# EAGLE design Lumiboard - main board (rev B) (EAGLE 6.4)
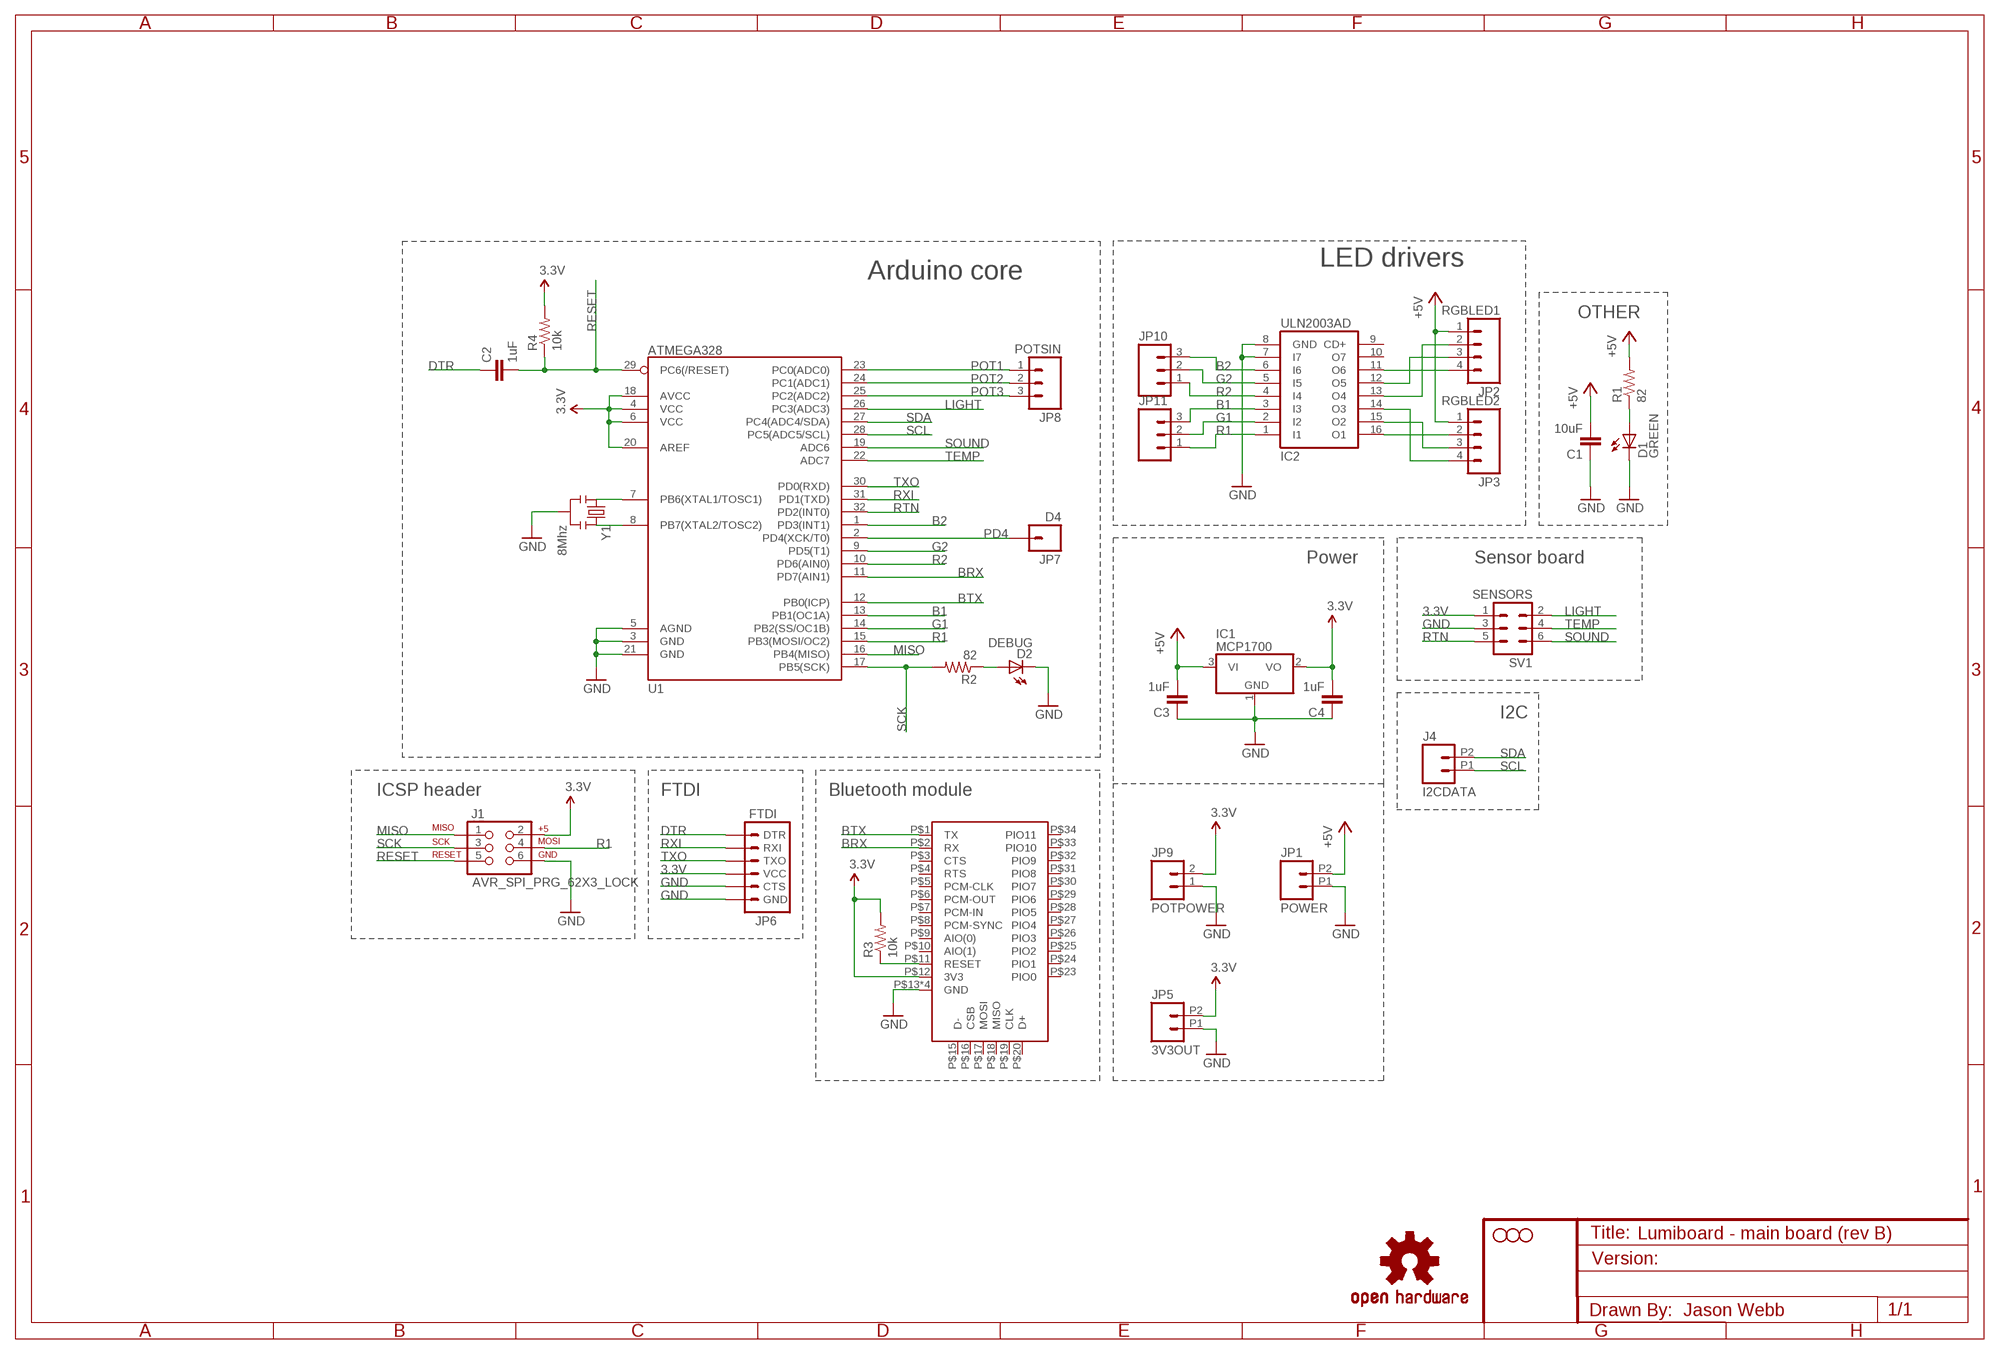
[diagram p0: schematic, sheet 1]

## Parts
C1  10uF  CAP0805  [0805]
C2  1uF  CAP0805  [0805]
C3  1uF  CAP0805  [0805]
C4  1uF  CAP0805  [0805]
D1  GREEN  LEDCHIPLED_0805  [CHIPLED_0805]
D2  DEBUG  LEDCHIPLED_0805  [CHIPLED_0805]
H1  STAND-OFFTIGHT  [STAND-OFF-TIGHT]
H2  STAND-OFFTIGHT  [STAND-OFF-TIGHT]
H3  STAND-OFFTIGHT  [STAND-OFF-TIGHT]
IC1  MCP1700  MCP1703CB  [SOT23]
IC2  ULN2003AD  [SO16]
J1  AVR_SPI_PRG_62X3_LOCK  [2X3_LOCK]
J4  I2CDATA  M022.54MM_SCREWTERM  [1X02_2.54_SCREWTERM]
JP1  POWER  M022.54MM_SCREWTERM  [1X02_2.54_SCREWTERM]
JP2  RGBLED1  M04PTH  [1X04]
JP3  RGBLED2  M04PTH  [1X04]
JP5  3V3OUT  M022.54MM_SCREWTERM  [1X02_2.54_SCREWTERM]
JP6  FTDI  ARDUINO_SERIAL_PROGRAMLOCK  [1X06_LOCK]
JP7  D4  M01PTH  [1X01]
JP8  POTSIN  M03PTH  [1X03]
JP9  POTPOWER  M02PTH  [1X02]
JP10  M03PTH  [1X03]
JP11  M03PTH  [1X03]
LOGO1  OSHW-LOGOL  [OSHW-LOGO-L]
R1  82  R-US_R0805  [R0805]
R2  82  R-US_R0805  [R0805]
R3  10k  R-US_R0805  [R0805]
R4  10k  R-US_R0805  [R0805]
SV1  SENSORS  ML6  [ML6]
U1  ATMEGA328  ATMEGA168  [TQFP32-08]
U2  DX_BT_MODULE  [DXBLUETOOTHMODULE]
Y1  8Mhz  RESONATORSMD  [RESONATOR-SMD]

## Nets
3.3V: C4.2 IC1.2(VO) J1.2 JP5.P2 JP6.4(VCC) JP9.2 R3.2 R4.2 SV1.1 U1.4(VCC) U1.6(VCC) U1.18(AVCC) U1.20(AREF) U2.P$12(3V3)
+5V: C1.2 C3.2 IC1.3(VI) JP1.P2 JP2.1 JP3.1 R1.2
B1: IC2.3(I3) JP11.3 U1.13(PB1(OC1A))
B2: IC2.6(I6) JP10.3 U1.1(PD3(INT1))
BRX: U1.11(PD7(AIN1)) U2.P$2(RX)
BTRESET: R3.1 U2.P$11(RESET)
BTX: U1.12(PB0(ICP)) U2.P$1(TX)
DTR: C2.1 JP6.1(DTR)
G1: IC2.2(I2) JP11.2 U1.14(PB2(SS/OC1B))
G2: IC2.5(I5) JP10.2 U1.9(PD5(T1))
GND: C1.1 C3.1 C4.1 D1.C D2.C IC1.1(GND) IC2.7(I7) IC2.8(GND) J1.6 JP1.P1 JP5.P1 JP6.5(CTS) JP6.6(GND) JP9.1 SV1.3 U1.3(GND) U1.5(AGND) U1.21(GND) U2.P$13(GND) U2.P$14(GND) U2.P$21(GND) U2.P$22(GND) Y1.2
LIGHT: SV1.2 U1.26(PC3(ADC3))
MISO: J1.1 U1.16(PB4(MISO))
N$1: IC2.16(O1) JP3.2
N$3: IC2.15(O2) JP3.3
N$4: IC2.13(O4) JP2.2
N$5: IC2.14(O3) JP3.4
N$6: IC2.12(O5) JP2.3
N$7: U1.7(PB6(XTAL1/TOSC1)) Y1.1
N$8: U1.8(PB7(XTAL2/TOSC2)) Y1.3
N$9: D1.A R1.1
N$10: IC2.11(O6) JP2.4
N$13: D2.A R2.1
PD4: JP7.1 U1.2(PD4(XCK/T0))
POT1: JP8.1 U1.23(PC0(ADC0))
POT2: JP8.2 U1.24(PC1(ADC1))
POT3: JP8.3 U1.25(PC2(ADC2))
R1: IC2.1(I1) J1.4 JP11.1 U1.15(PB3(MOSI/OC2))
R2: IC2.4(I4) JP10.1 U1.10(PD6(AIN0))
RESET: C2.2 J1.5 R4.1 U1.29(PC6(/RESET))
RTN: SV1.5 U1.32(PD2(INT0))
RXI: JP6.2(RXI) U1.31(PD1(TXD))
SCK: J1.3 R2.2 U1.17(PB5(SCK))
SCL: J4.P1 U1.28(PC5(ADC5/SCL))
SDA: J4.P2 U1.27(PC4(ADC4/SDA))
SOUND: SV1.6 U1.19(ADC6)
TEMP: SV1.4 U1.22(ADC7)
TXO: JP6.3(TXO) U1.30(PD0(RXD))
Unconnected: IC2.9(CD+) IC2.10(O7) U2.P$3(CTS) U2.P$4(RTS) U2.P$5(PCM-CLK) U2.P$6(PCM-OUT) U2.P$7(PCM-IN) U2.P$8(PCM-SYNC) U2.P$9(AIO(0)) U2.P$10(AIO(1)) U2.P$15(D-) U2.P$16(CSB) U2.P$17(MOSI) U2.P$18(MISO) U2.P$19(CLK) U2.P$20(D+) U2.P$23(PIO0) U2.P$24(PIO1) U2.P$25(PIO2) U2.P$26(PIO3) U2.P$27(PIO4) U2.P$28(PIO5) U2.P$29(PIO6) U2.P$30(PIO7) U2.P$31(PIO8) U2.P$32(PIO9) U2.P$33(PIO10) U2.P$34(PIO11)

## Notes on the sheet
- LED drivers
- Arduino core
- OTHER
- Power | Sensor board
- I2C
- ICSP header | FTDI | Bluetooth module
- Jason Webb

## Library data of the parts
C1-C4 = SparkFun:CAP: Capacitor Standard 0603 ceramic capacitor, and 0.1" leaded capacitor.
D1 D2 = led:LED: LED OSRAM: - CHIPLED LG R971, LG N971, LY N971, LG Q971, LY Q971, LO R971, LY R971 LH N974, LH R974 LS Q976, LO Q976, LY Q976 LO Q996 - Hyper CHIPLED LW Q18S LB Q993, LB Q99A, LB R99A - SideLED LS A670, LO A670, LY A670, LG A670, LP A670 LB A673, LV A673, LT A673, LW A673 LH A674 LY A675 LS A676, LA A676, LO A676, LY A676, LW A676 LS A679, LY A679, LG A679 - Hyper Micro SIDELED® LS Y876, LA Y876, LO Y876, LY Y876 LT Y87S - SmartLED LW L88C, LW L88S LB L89C, LB L89S, LG L890 LS L89K, LO L89K, LY L89K LS L896, LA L896, LO L896, LY L896 - TOPLED LS T670, LO T670, LY T670, LG T670, LP T670 LSG T670, LSP T670, LSY T670, LOP T670, LYG T670 LG T671, LOG T671, LSG T671 LB T673, LV T673, LT T673, LW T673 LH T674 LS T676, LA T676, LO T676, LY T676, LB T676, LH T676, LSB T676, LW T676 LB T67C, LV T67C, LT T67C, LS T67K, LO T67K, LY T67K, LW E67C LS E67B, LA E67B, LO E67B, LY E67B, LB E67C, LV E67C, LT E67C LW T67C LS T679, LY T679, LG T679 LS T770, LO T770, LY T770, LG T770, LP T770 LB T773, LV T773, LT T773, LW T773 LH T774 LS E675, LA E675, LY E675, LS T675 LS T776, LA T776, LO T776, LY T776, LB T776 LHGB T686 LT T68C, LB T68C - Hyper Mini TOPLED® LB M676 - Mini TOPLED Santana® LG M470 LS M47K, LO M47K, LY M47K Source: http://www.osram.convergy.de LUXEON: - LUMILED® LXK2-PW12-R00, LXK2-PW12-S00, LXK2-PW14-U00, LXK2-PW14-V00 LXK2-PM12-R00, LXK2-PM12-S00, LXK2-PM14-U00 LXK2-PE12-Q00, LXK2-PE12-R00, LXK2-PE12-S00, LXK2-PE14-T00, LXK2-PE14-U00 LXK2-PB12-K00, LXK2-PB12-L00, LXK2-PB12-M00, LXK2-PB14-N00, LXK2-PB14-P00, LXK2-PB14-Q00 LXK2-PR12-L00, LXK2-PR12-M00, LXK2-PR14-Q00, LXK2-PR14-R00 LXK2-PD12-Q00, LXK2-PD12-R00, LXK2-PD12-S00 LXK2-PH12-R00, LXK2-PH12-S00 LXK2-PL12-P00, LXK2-PL12-Q00, LXK2-PL12-R00 Source: www.luxeon.com KINGBRIGHT: KA-3528ASYC Source: www.kingbright.com
H1-H3 = SparkFun:STAND-OFF: Stand Off This is the mechanical footprint for a #4 phillips button head screw. Use the keepout ring to avoid running the screw head into surrounding components. SKU : PRT-00447
IC1 = linear:MCP1703: 250 mA, 16V, Low Quiescent Current LDO Regulator Source: http://ww1.microchip.com/downloads/en/DeviceDoc/22049b.pdf
IC2 = uln-udn:ULN2003A: DRIVER ARRAY
J1 = SparkFun-Connectors:AVR_SPI_PRG_6: AVR ISP 6 Pin This is the reduced ISP connector for AVR programming. Common on Arduino. This footprint will take up less PCB space and can be used with a 10-pin to 6-pin adapter such as SKU: BOB-08508
J4 JP1 JP5 = SparkFun-Connectors:M02: Standard 2-pin 0.1" header. Use with - straight break away headers ( PRT-00116) - right angle break away headers (PRT-00553) - swiss pins (PRT-00743) - machine pins (PRT-00117) - female headers (PRT-00115) Molex polarized connector foot print use with: PRT-08233 with associated crimp pins and housings. 2.54_SCREWTERM for use with PRT-10571. 3.5mm Screw Terminal footprints for PRT-08084 5mm Screw Terminal footprints for use with PRT-08433
JP2 JP3 = SparkFun-Connectors:M04: Header 4 Standard 4-pin 0.1" header. Use with straight break away headers (SKU : PRT-00116), right angle break away headers (PRT-00553), swiss pins (PRT-00743), machine pins (PRT-00117), and female headers (PRT-00115). Molex polarized connector foot print use with SKU : PRT-08231 with associated crimp pins and housings. 1MM SMD Version SKU: PRT-10208
JP6 = SparkFun:ARDUINO_SERIAL_PROGRAM
JP7 = SparkFun-Connectors:M01: Header 1 Standard 1-pin 0.1" header. Use with straight break away headers (SKU : PRT-00116), right angle break away headers (PRT-00553), swiss pins (PRT-00743), machine pins (PRT-00117), and female headers (PRT-00115).
JP8 = SparkFun:M03: Header 3 Standard 3-pin 0.1" header. Use with straight break away headers (SKU : PRT-00116), right angle break away headers (PRT-00553), swiss pins (PRT-00743), machine pins (PRT-00117), and female headers (PRT-00115). Molex polarized connector foot print use with SKU : PRT-08232 with associated crimp pins and housings.
JP9 = SparkFun:M02: Header 2 Standard 2-pin 0.1" header. Use with straight break away headers (SKU : PRT-00116), right angle break away headers (PRT-00553), swiss pins (PRT-00743), machine pins (PRT-00117), and female headers (PRT-00115). Molex polarized connector foot print use with SKU : PRT-08233 with associated crimp pins and housings.
JP10 JP11 = SparkFun-Connectors:M03: Header 3 Standard 3-pin 0.1" header. Use with straight break away headers (SKU : PRT-00116), right angle break away headers (PRT-00553), swiss pins (PRT-00743), machine pins (PRT-00117), and female headers (PRT-00115). Molex polarized connector foot print use with SKU : PRT-08232 with associated crimp pins and housings.
LOGO1 = SparkFun-Aesthetics:OSHW-LOGO: Open Source Hardware Logo This logo indicates the piece of hardware it is found on incorporates a OSHW license and/or adheres to the definition of open source hardware found here: http://freedomdefined.org/OSHW
R1-R4 = resistor:R-US_: RESISTOR, American symbol
SV1 = con-harting-ml:ML6: HARTING; OC_FARNELL: unknown; OC_NEWARK: unknown
U1 = SparkFun:ATMEGA168
U2 = Richardson:DX_BT_MODULE: http://www.dealextreme.com/p/wireless-bluetooth-rs232-ttl-transceiver-module-80711
Y1 = SparkFun:RESONATOR: Resonator Small SMD resonator. This is the itty bitty 10/20MHz resonators with built in caps. CSTCE10M0G55 and CSTCE20M0V53. Footprint has been reviewed closely but hasn't been tested yet.

## Net classes
0 Power: width 0.254 mm, drill 0.305 mm, clearance 0.203 mm

## Board
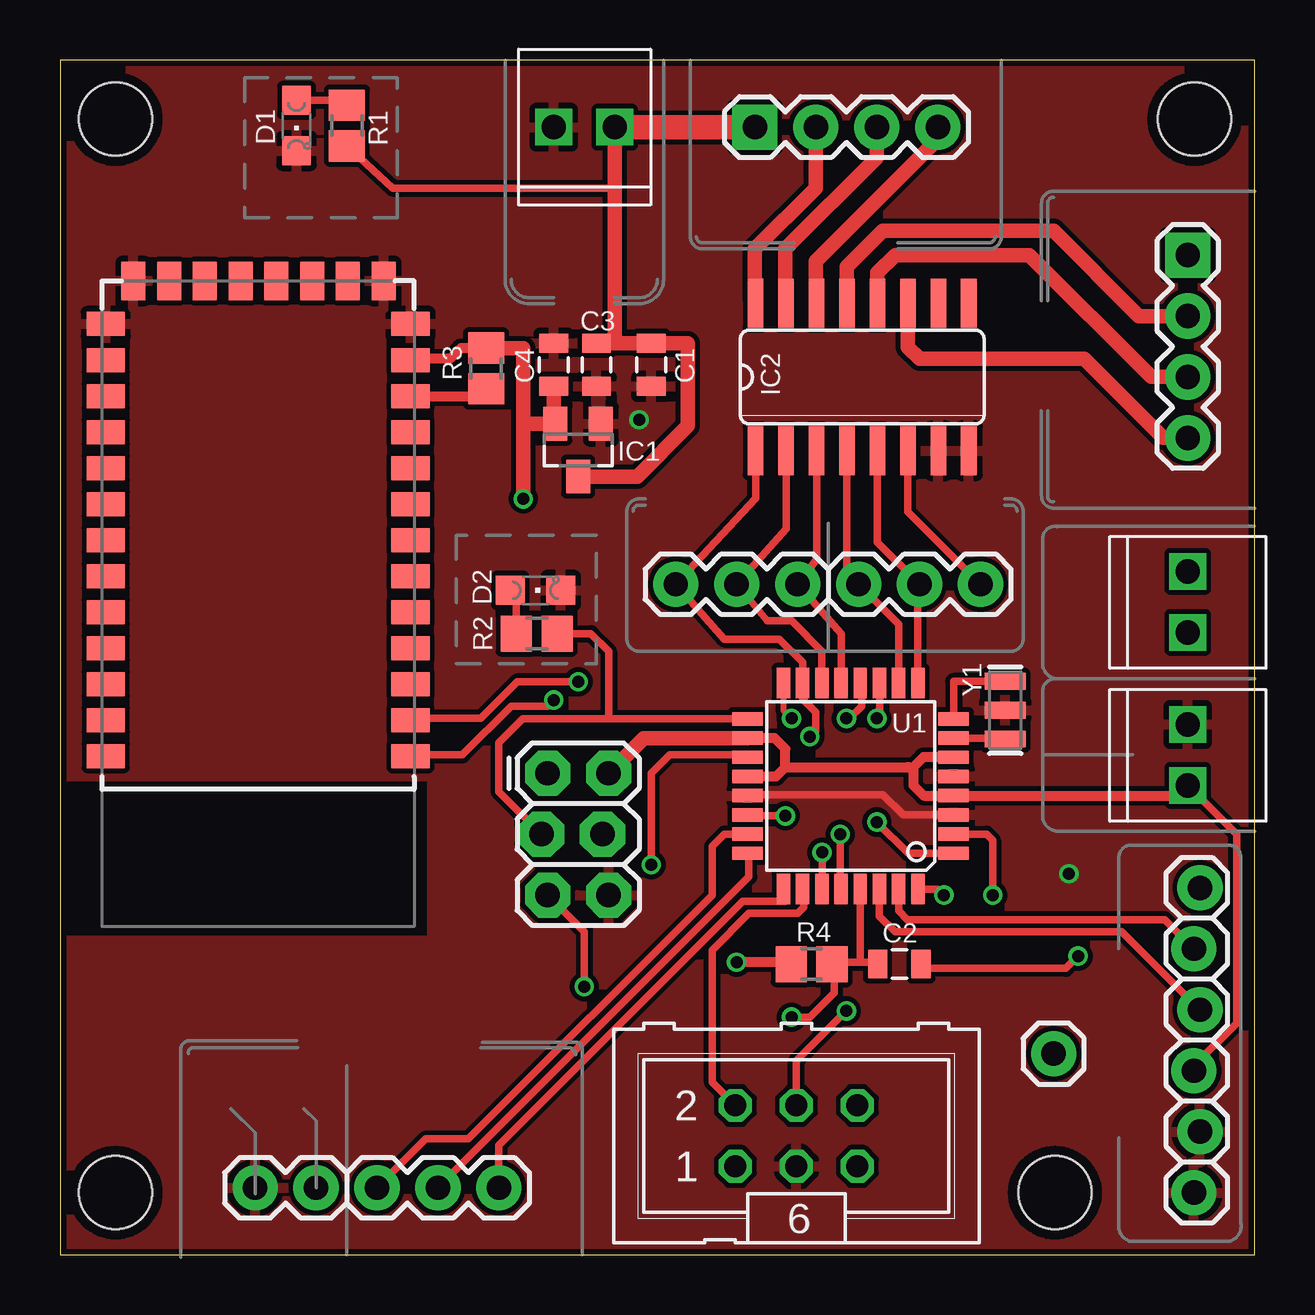
[diagram p1: board, top side]
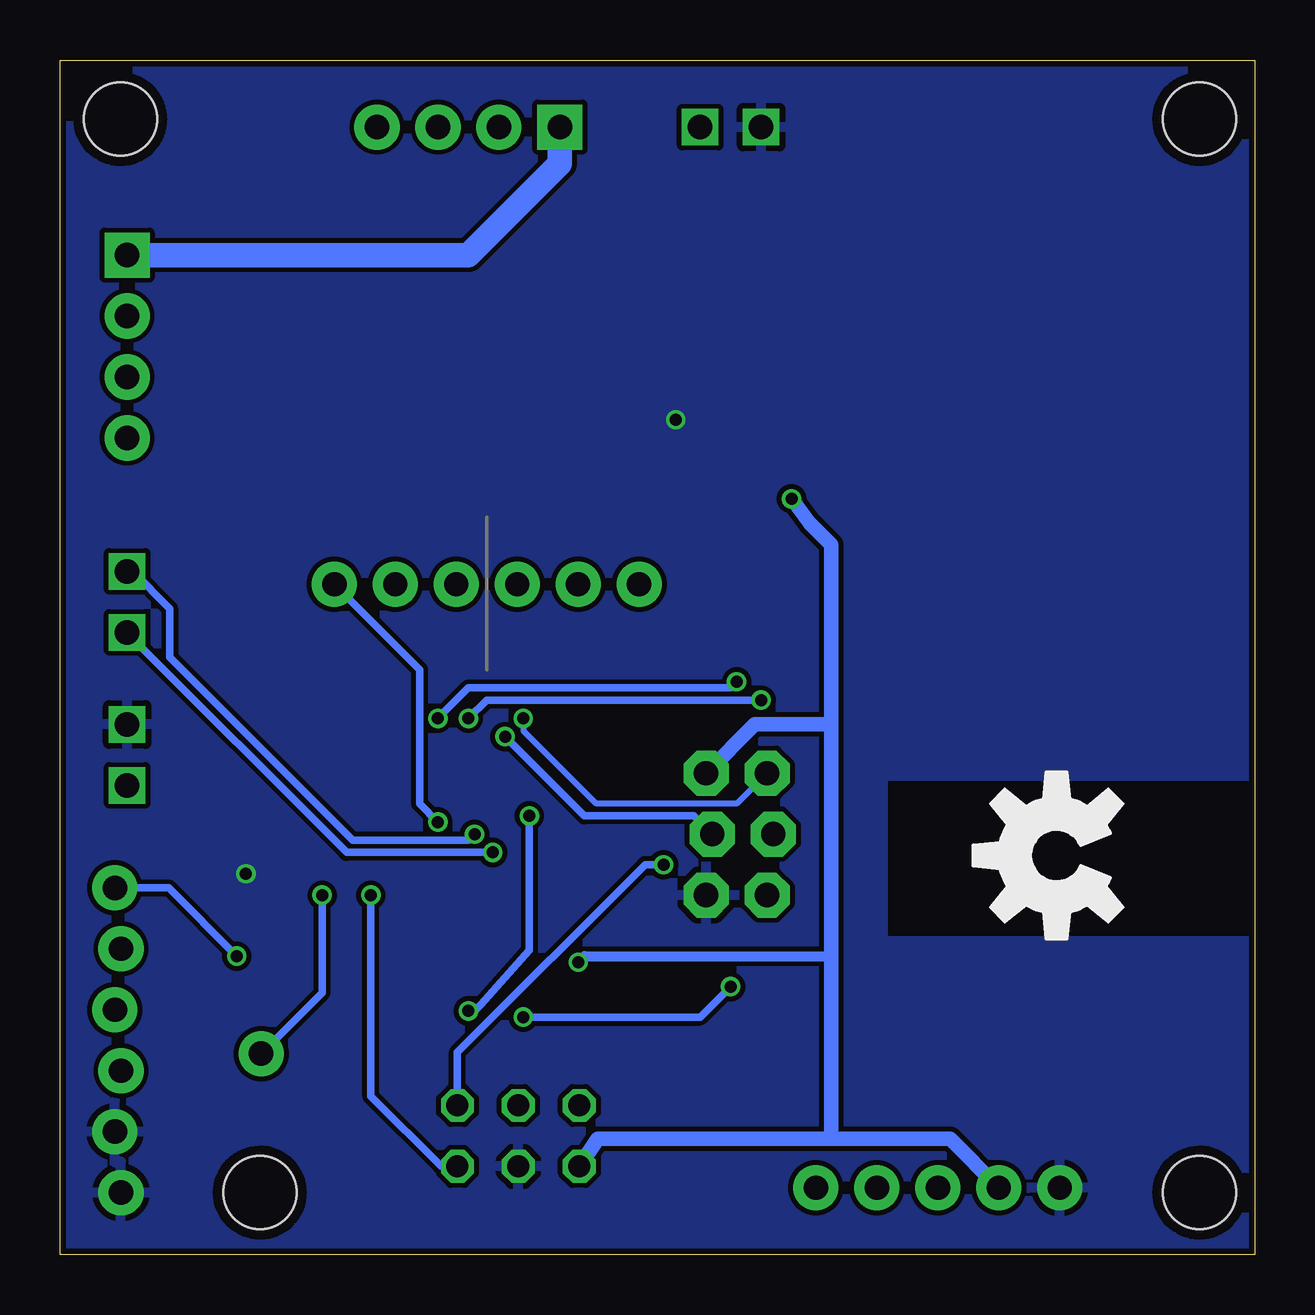
[diagram p2: board, bottom side, seen from below]

Size 49.78 x 49.78 mm. Coordinates in mm from the lower left corner, seen from the top.
Outline: 0,0 49.78,0 49.78,49.78 0,49.78 0,0
Copper layers (1*2*15*16): Top 0.035mm / dielectric 0.2mm / layer 2 0.0175mm / dielectric 1.1mm / layer 15 0.0175mm / dielectric 0.2mm / Bottom 0.035mm
Design rules "SeeedStudio_DRU_no_angle_20130527": minimum track width 6mil, minimum drill 12mil, track to track 6mil, track to pad 6mil, pad to pad 6mil, via to via 6mil, smd to smd 0mil, copper to edge 10mil, drill to drill 10mil, minimum pad ring 6mil, minimum via ring 6mil, stop-mask expansion 2mil, vias tented up to drill 25mil, thermal gap 10mil

### Footprints (pad centres in the part's own frame; a part is rotated, then mirrored left to right if it is on the bottom)
0805 = smd 0.8 x 1.2: 1 -0.9,0; 2 0.9,0
CHIPLED_0805 = smd 1.2 x 1.2: A 0,-1.05; C 0,1.05
STAND-OFF-TIGHT = hole 3.048: 0,0
SOT23 = smd 1 x 1.4: 1 -0.95,-1.1; 2 0.95,-1.1; 3 0,1.1
SO16 = smd 0.66 x 2.032: 1 -4.445,-3.073; 2 -3.175,-3.073; 3 -1.905,-3.073; 4 -0.635,-3.073; 5 0.635,-3.073; 6 1.905,-3.073; 7 3.175,-3.073; 8 4.445,-3.073; 9 4.445,3.073; 10 3.175,3.073; 11 1.905,3.073; 12 0.635,3.073; 13 -0.635,3.073; 14 -1.905,3.073; 15 -3.175,3.073; 16 -4.445,3.073
2X3_LOCK = drill 1.016 pad 1.88 octagon: 1 0,0; 2 0,2.54; 3 2.54,-0.254; 4 2.54,2.286; 5 5.08,0; 6 5.08,2.54
1X02_2.54_SCREWTERM = drill 1.016 square: P1 2.54,0; P2 0,0
1X04 = drill 1.016 pad 1.88 square: 1 0,0 | drill 1.016 pad 1.88: 2 2.54,0; 3 5.08,0; 4 7.62,0
1X06_LOCK = drill 1.016 pad 1.88: 1 0,0; 2 2.54,-0.254; 3 5.08,0; 4 7.62,-0.254; 5 10.16,0; 6 12.7,-0.254
1X01 = drill 1.016 pad 1.88: 1 0,0
1X03 = drill 1.016 pad 1.88: 1 0,0; 2 2.54,0; 3 5.08,0
1X02 = drill 1.016 pad 1.88: 1 0,0; 2 2.54,0
R0805 = smd 1.3 x 1.5: 1 -0.85,0; 2 0.85,0
ML6 = drill 0.914 octagon: 1 -2.54,-1.27; 2 -2.54,1.27; 3 0,-1.27; 4 0,1.27; 5 2.54,-1.27; 6 2.54,1.27
TQFP32-08 = smd 1.27 x 0.559: 1 -4.293,2.8; 2 -4.293,2; 3 -4.293,1.2; 4 -4.293,0.4; 5 -4.293,-0.4; 6 -4.293,-1.2; 7 -4.293,-2; 8 -4.293,-2.8; 17 4.293,-2.8; 18 4.293,-2; 19 4.293,-1.2; 20 4.293,-0.4; 21 4.293,0.4; 22 4.293,1.2; 23 4.293,2; 24 4.293,2.8 | smd 0.559 x 1.27: 9 -2.8,-4.293; 10 -2,-4.293; 11 -1.2,-4.293; 12 -0.4,-4.293; 13 0.4,-4.293; 14 1.2,-4.293; 15 2,-4.293; 16 2.8,-4.293; 25 2.8,4.293; 26 2,4.293; 27 1.2,4.293; 28 0.4,4.293; 29 -0.4,4.293; 30 -1.2,4.293; 31 -2,4.293; 32 -2.8,4.293
DXBLUETOOTHMODULE = smd 1.6 x 1: P$1 -6.35,6.35; P$2 -6.35,4.85; P$3 -6.35,3.35; P$4 -6.35,1.85; P$5 -6.35,0.35; P$6 -6.35,-1.15; P$7 -6.35,-2.65; P$8 -6.35,-4.15; P$9 -6.35,-5.65; P$10 -6.35,-7.15; P$11 -6.35,-8.65; P$12 -6.35,-10.15; P$13 -6.35,-11.66; P$22 6.35,-11.66; P$23 6.35,-10.15; P$24 6.35,-8.65; P$25 6.35,-7.15; P$26 6.35,-5.65; P$27 6.35,-4.15; P$28 6.35,-2.65; P$29 6.35,-1.15; P$30 6.35,0.35; P$31 6.35,1.85; P$32 6.35,3.35; P$33 6.35,4.85; P$34 6.35,6.35 | smd 1 x 1.6: P$14 -5.23,-13.45; P$15 -3.74,-13.45; P$16 -2.25,-13.45; P$17 -0.76,-13.45; P$18 0.73,-13.45; P$19 2.22,-13.45; P$20 3.71,-13.45; P$21 5.2,-13.45
RESONATOR-SMD = smd 0.7 x 1.7: 1 -1.2,0; 2 0,0; 3 1.2,0

### Placement (x,y rotation side)
C1  24.64,37.08 90 top
C2  34.98,12.12 180 top
C3  22.35,37.08 90 top
C4  20.57,37.08 270 top
D1  9.86,47.05 180 top
D2  19.81,27.69 270 top
H1  2.31,47.32 0 top
H2  2.31,2.59 0 top
H3  41.45,2.59 0 top
H4  STAND-OFFTIGHT  [STAND-OFF-TIGHT]  47.27,47.32 0 top
IC1  21.59,33.53 180 top
IC2  33.43,36.58 0 top
J1  20.32,20.07 270 top
J4  46.99,25.93 90 top
JP1  23.11,46.99 180 top
JP2  46.99,41.66 270 top
JP3  28.96,46.99 0 top
JP5  46.99,19.56 90 top
JP6  47.5,15.29 270 top
JP7  41.4,8.38 0 top
JP8  13.21,2.79 0 top
JP9  8.13,2.79 0 top
JP10  33.27,27.94 0 top
JP11  25.65,27.94 0 top
LOGO1  8.26,16.64 90 bottom
R1  11.95,47.05 270 top
R2  19.86,25.88 0 top
R3  17.75,36.93 90 top
R4  31.32,12.12 180 top
SV1  30.68,4.95 0 top
U1  32.94,19.53 180 top
U2  8.26,27.13 180 top
Y1  39.38,22.69 90 top

### Tracks (layer width: path | path; a pad name or v marks a point on that pad's centre or on a via)
3.3V  (via drill 0.5)
  Top 0.305: JP5.P2 49.02,17.53 49.02,9.65 47.24,7.87 JP6.4
  Top 0.406: U1.6 35.97,20.73 35.56,20.32 35.56,20.07 | 35.56,20.07 35.56,19.56 35.98,19.13 U1.4 46.56,19.13 JP5.P2 | U1.20 29.84,19.93 30.23,20.32 | 30.23,20.32 30.23,21.08 29.77,21.53 U1.18 | 30.23,20.32 35.31,20.32 arc-90 35.56,20.07 | R4.2 30.39,12.19 v28.19,12.19 | R3.2 16.7,37.78 16.26,37.34 14.67,37.34 U2.P$12
  Top 0.61: v28.19,12.19 28.27,12.12 | J1.2 24.33,21.53 U1.18 | R3.2 19.3,37.78 19.3,34.63 | 19.3,34.63 v19.3,31.5 | C4.2 20.57,34.73 20.53,34.73 IC1.2 19.3,34.63
  Bottom 0.406: v28.19,12.19 27.94,12.45 17.65,12.45
  Bottom 0.61: v19.3,31.5 18.54,30.48 17.65,29.59 17.65,21.97 | J1.2 20.83,22.1 17.78,22.1 arc90 17.65,21.97 | SV1.1 27.38,4.83 17.65,4.83 | 17.65,4.83 12.7,4.83 JP9.2 | 17.65,21.97 17.65,12.45 17.65,4.83
+5V
  Top 0.305: R1.2 13.86,44.45 22.86,44.45 23.11,44.2
  Top 0.61: IC1.3 24.05,32.43 26.16,34.54 26.16,37.98 C1.2 22.86,37.98 | JP1.P2 23.11,44.2 23.11,38.24 22.86,37.98 | 22.86,37.98 C3.2
  Top 1.016: JP1.P2 JP3.1
  Bottom 1.016: JP3.1 28.96,45.47 32.77,41.66 JP2.1
B1
  Top 0.305: IC2.3 31.52,28.98 JP11.3 32.54,25.88 U1.13
B2  (via drill 0.5)
  Top 0.305: 37.08,16.76 U1.1 35.34,16.73 v34.04,18.03 | JP10.3 35.33,30.96 IC2.6
  Bottom 0.305: JP10.3 34.8,24.38 34.8,18.8 v34.04,18.03
BRX  (via drill 0.5)
  Top 0.305: v21.59,23.88 19.05,23.88 17.53,22.35 14.73,22.35 U2.P$2 | 34.04,23.62 U1.11 34.16,23.62 34.16,22.48 v34.04,22.35
  Bottom 0.305: v21.59,23.88 21.84,23.62 32.77,23.62 v34.04,22.35
BTRESET
  Top 0.406: U2.P$11 17.45,35.78 R3.1
BTX  (via drill 0.5)
  Top 0.305: v20.57,23.11 20.32,22.86 18.8,22.86 16.76,20.83 14.73,20.83 U2.P$1 | 33.27,23.62 U1.12 33.4,23.62 33.4,22.86 32.89,22.35 v32.77,22.35
  Bottom 0.305: v20.57,23.11 32,23.11 v32.77,22.35
DTR  (via drill 0.5)
  Top 0.305: C2.1 36.07,11.94 36.32,11.94 41.91,11.94 v42.42,12.45
  Bottom 0.305: JP6.1 45.26,15.29 v42.42,12.45
G1
  Top 0.305: IC2.2 30.25,30.25 JP11.2 29.46,26.42 30.48,26.42 31.74,25.15 U1.14
G2
  Top 0.305: IC2.5 34.06,29.69 JP10.2 35.74,27.87 U1.9
GND  (via drill 0.5)
  Top 0.305: U1.3 35.13,18.33 34.29,19.18 28.7,19.18 U1.21
  other vias: 24.13,34.8 42.04,15.88
  pour Bottom: -0.25,-0.25 50.04,-0.25 50.04,50.04 -0.25,50.04 -0.25,19.94 15.49,19.94 15.49,13.08 -0.25,13.08
  pour Top: -0.25,-0.25 50.04,-0.25 50.04,50.04 -0.25,50.04 -0.25,19.94 15.49,19.94 15.49,13.08 -0.25,13.08
LIGHT
  Top 0.305: U1.26 30.99,15.24 30.99,14.48 30.73,14.22 28.7,14.22 27.18,12.7 27.18,7.19 SV1.2
MISO  (via drill 0.5)
  Top 0.254: U1.16 30.14,22.69 v30.48,22.35
  Bottom 0.254: J1.1 21.59,18.8 27.43,18.8 30.48,21.84 v30.48,22.35
N$1
  Top 0.61: JP3.2 31.5,44.45 28.96,41.91 28.96,39.88 IC2.16
N$3
  Top 0.61: JP3.3 34.04,45.72 30.23,41.91 30.23,39.88 IC2.15
N$4
  Top 0.61: IC2.13 32.79,41.17 34.29,42.67 41.4,42.67 44.96,39.12 JP2.2
N$5
  Top 0.61: JP3.4 36.58,46.48 31.5,41.4 31.5,39.88 IC2.14
N$6
  Top 0.61: IC2.12 34.06,40.92 34.8,41.66 40.39,41.66 45.47,36.58 JP2.3
N$7
  Top 0.305: U1.7 39.34,21.53 Y1.1
N$8
  Top 0.305: Y1.3 37.24,23.89 U1.8
N$9
  Top 0.305: D1.A 11.75,48.1 R1.1
N$10
  Top 0.61: IC2.11 35.33,37.82 35.81,37.34 42.67,37.34 45.97,34.04 JP2.4
N$13
  Top 0.305: R2.1 19.01,27.43 D2.A
PD4  (via drill 0.5)
  Top 0.305: v38.86,14.99 38.86,17.27 38.61,17.53 37.34,17.53 U1.2
  Bottom 0.305: v38.86,14.99 38.86,10.92 JP7.1
POT1
  Top 0.305: JP8.1 15.24,4.83 17.02,4.83 27.18,14.99 27.18,17.02 27.69,17.53 28.45,17.53 U1.23
POT2
  Top 0.305: JP8.2 28.7,15.75 28.7,16.51 U1.24
POT3
  Top 0.305: JP8.3 18.29,4.57 28.45,14.73 30.23,14.73 30.23,15.24 U1.25
R1  (via drill 0.5)
  Top 0.305: v31.24,21.59 31.5,21.84 31.5,22.61 30.94,23.16 U1.15 30.94,24.68 29.97,25.65 27.69,25.65 JP11.1 28.98,31.52 IC2.1
  Bottom 0.305: J1.4 23.37,18.29 27.94,18.29 v31.24,21.59
R2
  Top 0.305: IC2.4 32.79,28.42 JP10.1 34.94,26.27 U1.10
RESET  (via drill 0.5)
  Top 0.305: v30.48,9.91 31.24,9.91 32.26,10.92 32.26,11.94 R4.1 32,12.19 32.26,12.45 32.51,12.19 33.27,12.19 | 33.27,12.19 34.04,12.19 C2.2 | U1.29 33.34,12.26 33.27,12.19 | J1.5 21.84,13.46 v21.84,11.18
  Bottom 0.305: v30.48,9.91 23.11,9.91 v21.84,11.18
RTN  (via drill 0.5)
  Top 0.305: v36.83,14.99 36.58,15.24 U1.32
  Bottom 0.305: v36.83,14.99 36.83,6.6 33.91,3.68 SV1.5
RXI
  Top 0.305: JP6.2 46.02,13.97 35.31,13.97 34.94,14.33 U1.31
SCK
  Top 0.305: U1.17 22.86,22.33 | 22.86,22.33 19.29,22.33 18.29,21.34 18.29,19.3 J1.3 | R2.2 22.12,25.88 22.86,25.15 22.86,22.33
SCL  (via drill 0.5)
  Top 0.305: v32.51,17.53 32.51,15.24 U1.28
  Bottom 0.305: J4.P1 46.76,28.47 45.21,26.92 45.21,24.89 37.59,17.27 32.77,17.27 v32.51,17.53
SDA  (via drill 0.5)
  Top 0.305: v31.75,16.76 U1.27
  Bottom 0.305: J4.P2 46.99,25.91 37.85,16.76 v31.75,16.76
SOUND  (via drill 0.5)
  Top 0.305: U1.19 28.45,20.83 25.4,20.83 24.64,20.07 v24.64,16.26
  Bottom 0.305: v24.64,16.26 25.4,16.26 33.22,8.43 SV1.6
TEMP  (via drill 0.5)
  Top 0.305: v30.23,18.29 28.7,18.29 U1.22 | SV1.4 30.68,8.08 v32.77,10.16
  Bottom 0.305: v30.23,18.29 30.23,12.7 32.26,10.41 32.51,10.16 v32.77,10.16
TXO
  Top 0.305: U1.30 34.14,14.12 34.8,13.46 44.25,13.46 JP6.3

### Text on the board
Reference: Power in | RGB LED 1 | RGB LED 2 | I2C interface | Power breakout | FTDI interface (3.3V) | Potentiometers | Sensor board
tDocu: POWER | - | + | +5V | R | G | B | LED1 | POWER | +5V | IN | R | ULN2003 | LED2 | G | BLUETOOTH | TRANSCEIVER | B | LED1 | (RAW PWM) | LED2 | A4 | SDA | R | G | B | R | G | B | SCL | 11 | 10 | 9 | 6 | 5 | 3 | A5 | GND | MISO | 3.3V | 3.3V | SCK | MOSI | RST | GND | GRN | FTDI (3.3V) | REV B | POTS/INPUT | GND | 3.3V | A0 | A1 | A2 | BLK
bDocu: - | + | +5V | R | G | B | Designed by Jason Webb | +5V | http://jason-webb.info | Each LED pin can sink up to 500mA | R | Common anode LEDs only! | G | B | (RAW PWM) | R | G | B | R | G | B | SDA | SCL | LED1 | LED2 | GND | 3.3V | OSHW | DTR | RXI | TXO | A7 | A3 | A6 | 3V3 | GND | 3.3V | A0 | A1 | A2 | CTS | 3.3V | D2 | GND | GND